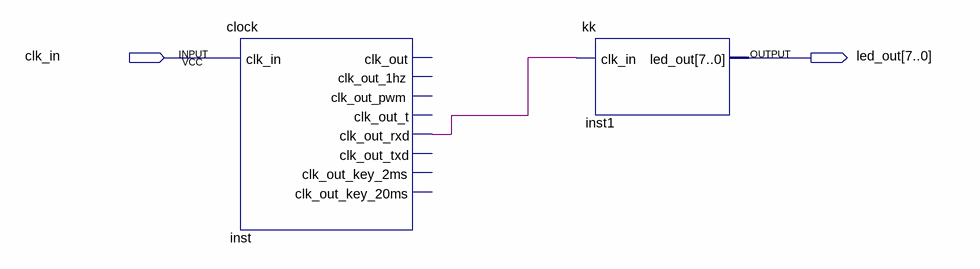
[diagram p0: schematic sheet]
// Quartus schematic kk_bdf.bdf as structural Verilog: 2 symbols, 2 pins
module kk_bdf (
  input  clk_in,
  output [7:0] led_out
);

  wire inst_clk_out_rxd;

  clock inst (
    .clk_in(clk_in), .clk_out_rxd(inst_clk_out_rxd));  // open: clk_out, clk_out_1hz, clk_out_pwm, clk_out_t, clk_out_txd, clk_out_key_2ms, clk_out_key_20ms
  kk inst1 (.clk_in(inst_clk_out_rxd), .led_out(led_out));
endmodule
